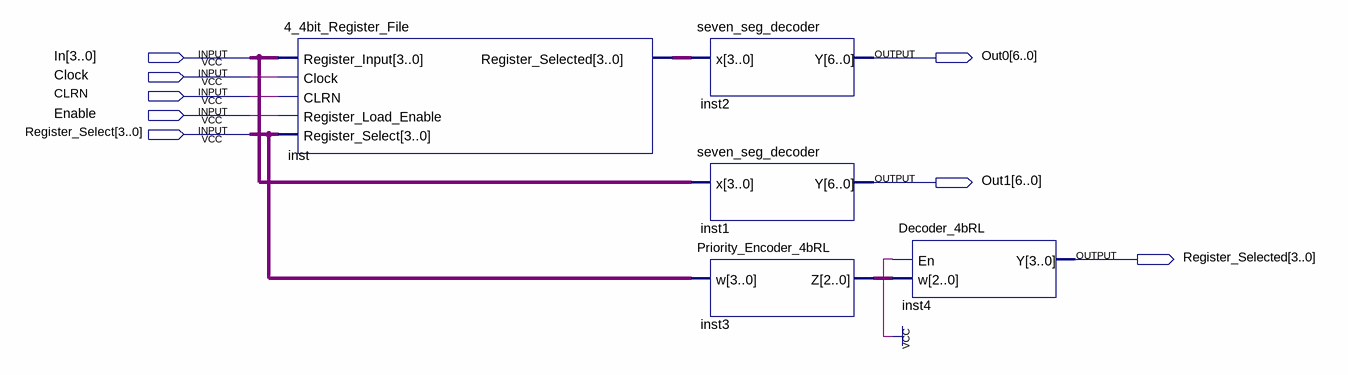
[diagram p0: schematic sheet]
// Quartus schematic Register_File_Test.bdf as structural Verilog: 5 symbols, 8 pins
module Register_File_Test (
  input  [3:0] In,
  input  Clock,
  input  CLRN,
  input  Enable,
  input  [3:0] Register_Select,
  output [6:0] Out0,
  output [6:0] Out1,
  output [3:0] Register_Selected
);

  wire [2:0] inst3_z;
  wire [3:0] inst_register_selected;

  \4_4bit_Register_File  inst (
    .Register_Input(In), .Clock(Clock), .CLRN(CLRN), .Register_Load_Enable(Enable),
    .Register_Select(Register_Select), .Register_Selected(inst_register_selected));
  seven_seg_decoder inst2 (.x(inst_register_selected), .Y(Out0));
  seven_seg_decoder inst1 (.x(In), .Y(Out1));
  Priority_Encoder_4bRL inst3 (.w(Register_Select), .Z(inst3_z));
  Decoder_4bRL inst4 (.En(1'b1), .w(inst3_z), .Y(Register_Selected));
endmodule
